# Altium schematic sheet 501_RPiCM4.SchDoc: RPi Compute Module 4
size A2; Organization: Greenfield Tech Solutions; Address1: Molendreef 33; Address2: Ossendrecht; Address3: 4641CS; Address4: The Netherlands; SheetNumber: 6; SheetTotal: 8
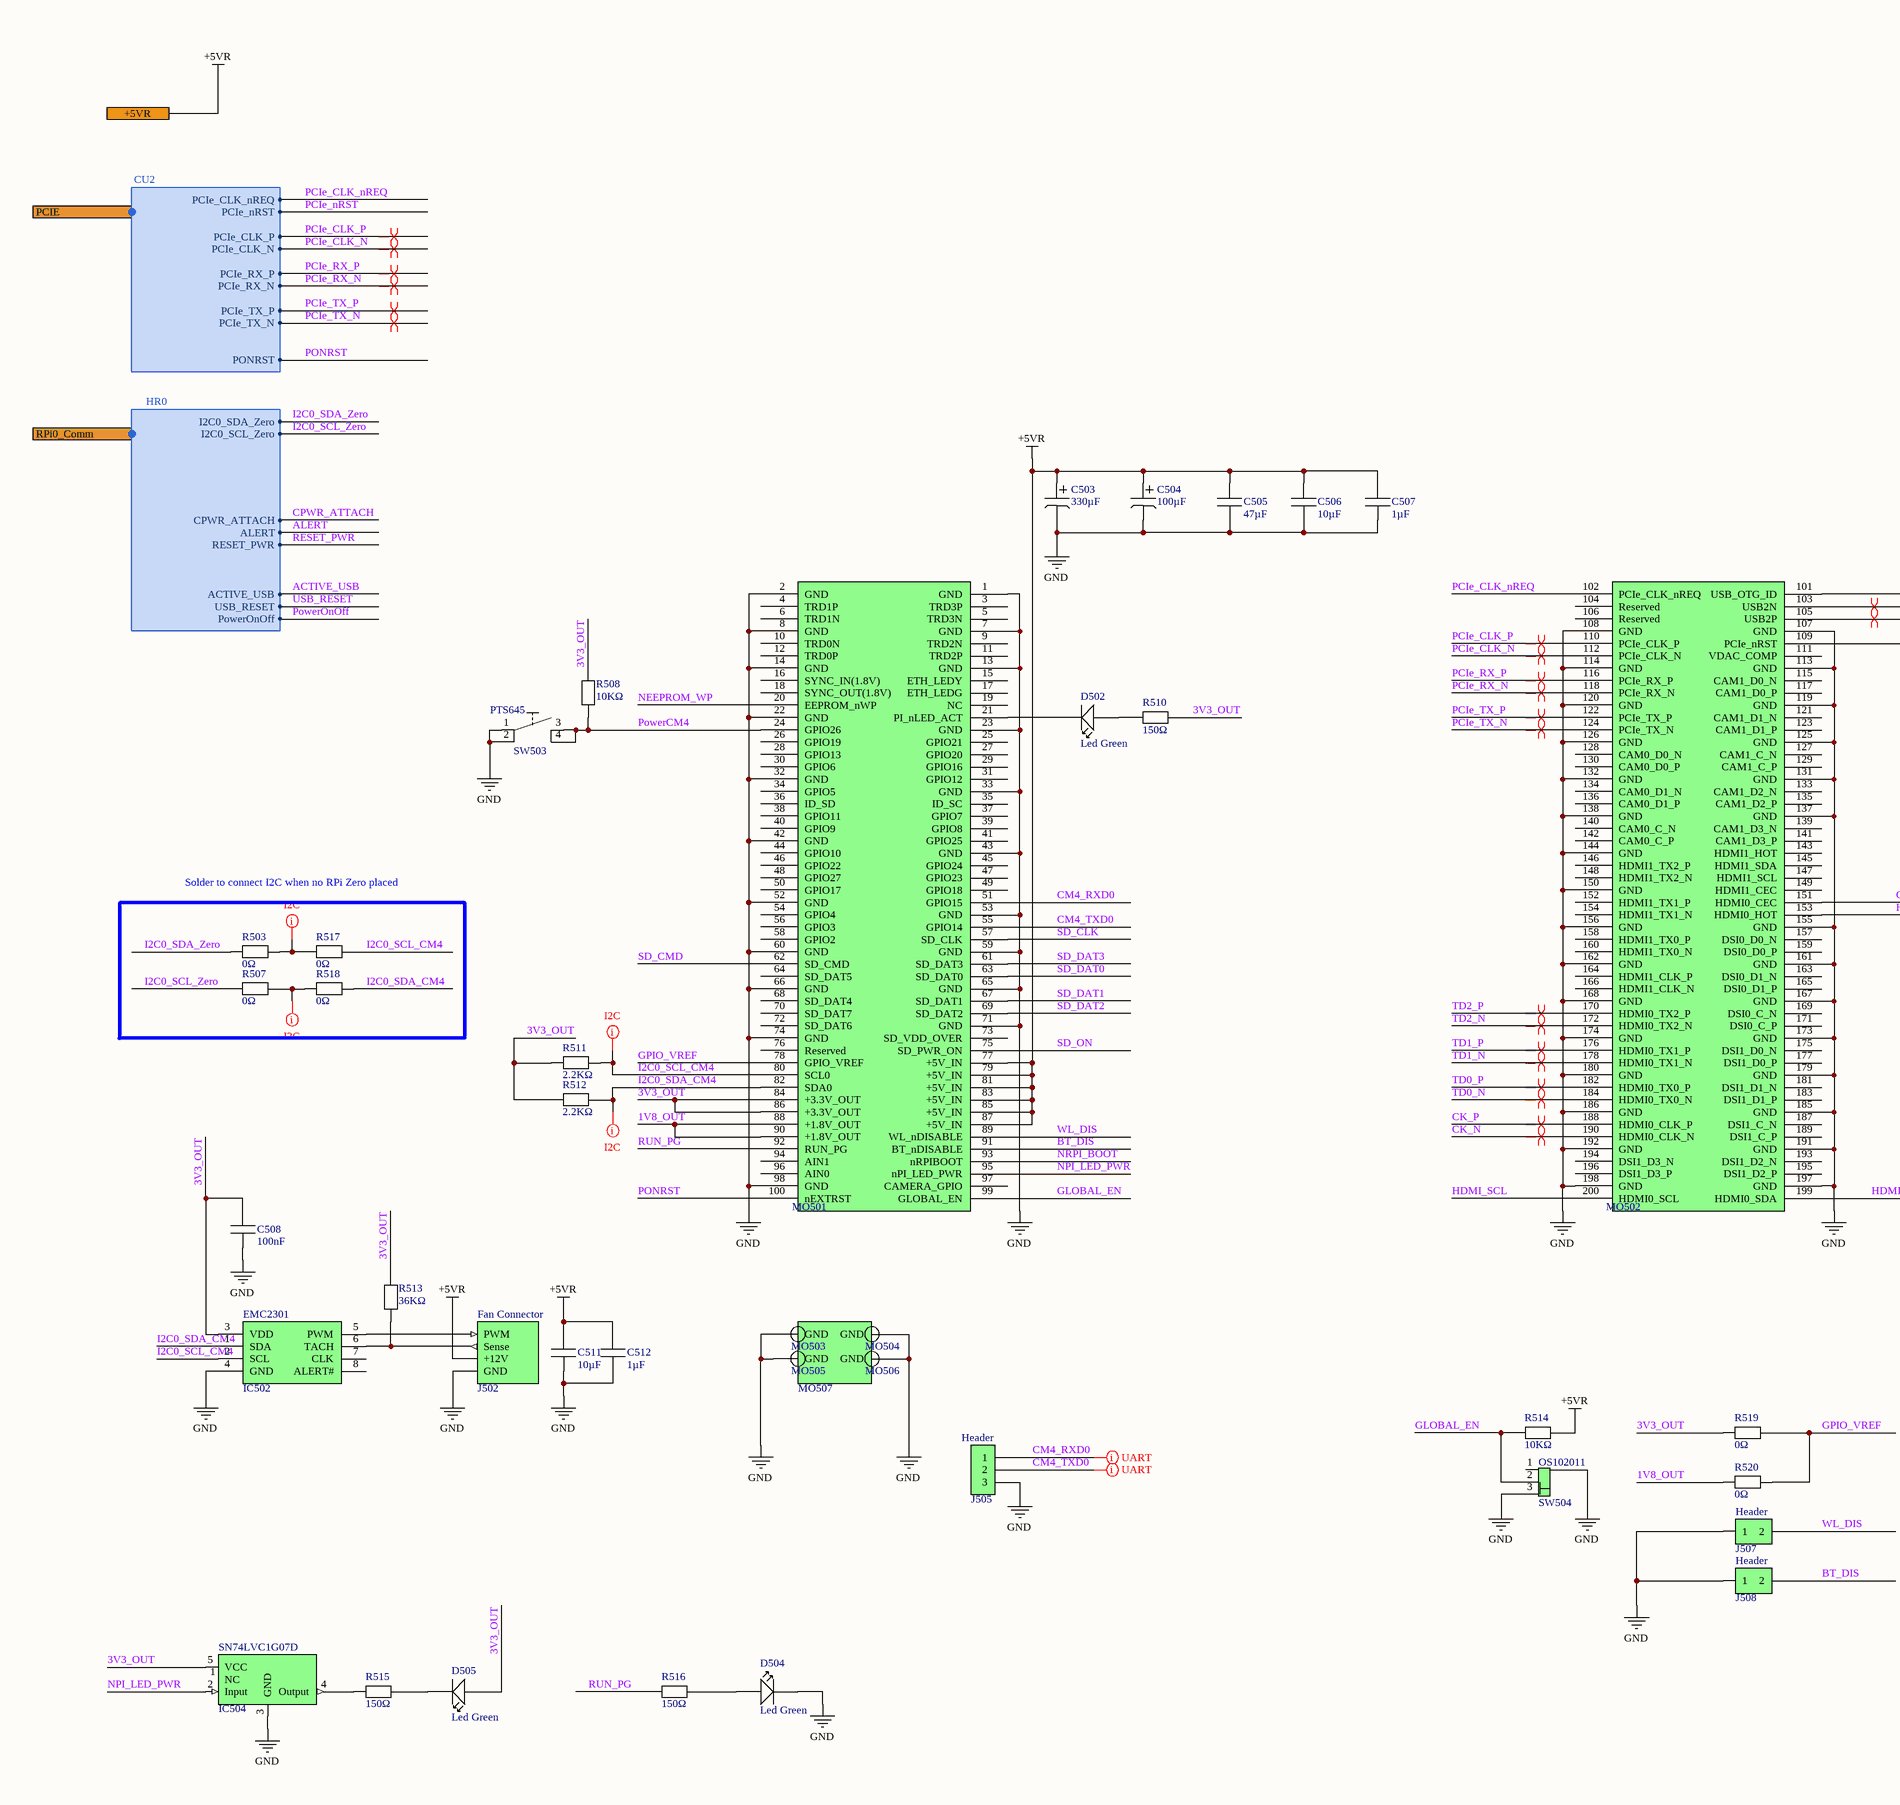
[diagram p0: 501_RPiCM4.SchDoc, left]
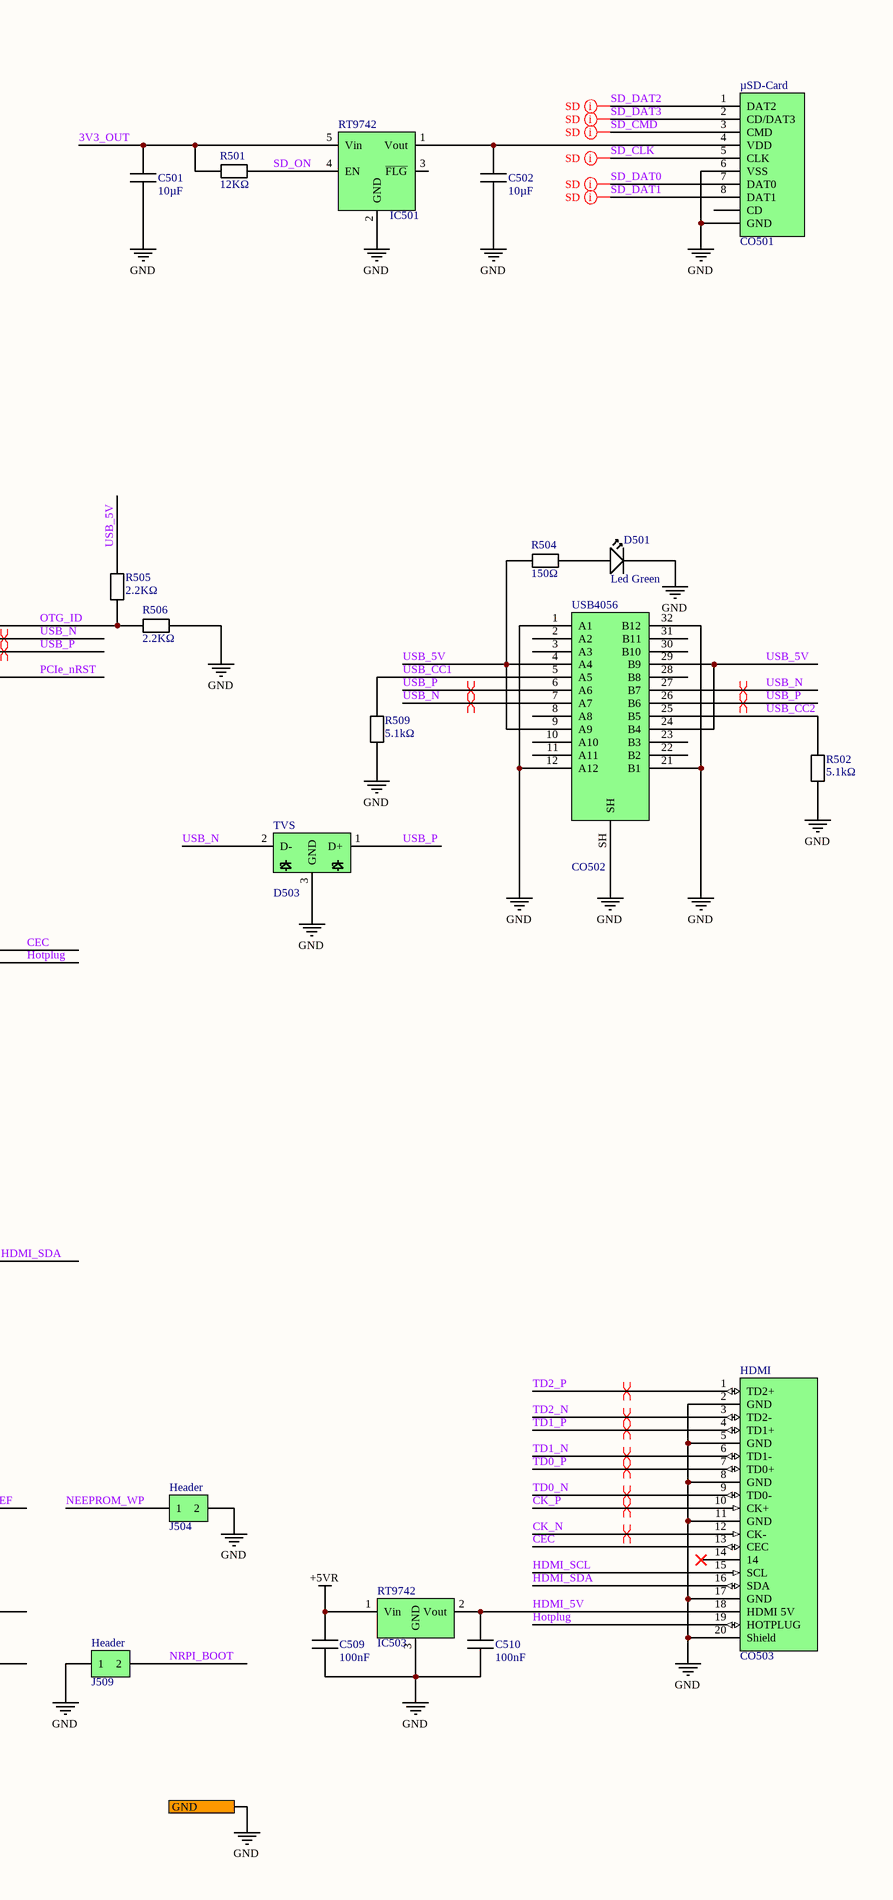
[diagram p1: 501_RPiCM4.SchDoc, right]

## Parts
C501  10µF  [C0603]
C502  10µF  [C0603]
C503  330µF  [EC_E7]
C504  100µF  [EC_B6]
C505  47µF  [C1210]
C506  10µF  [C0603]
C507  1µF  [C0603]
C508  100nF  [C0402]
C509  100nF  [C0402]
C510  100nF  [C0402]
C511  10µF  [C0603]
C512  1µF  [C0603]
CO501  µSD-Card  [693071030811]
CO502  USB4056  [USB4056-03-A]
CO503  HDMI  [HDMI]
D501  Led Green  [Led0805]
D502  Led Green  [Led0805]
D503  TVS  [SOT-3]
D504  Led Green  [Led0805]
D505  Led Green  [Led0805]
IC501  RT9742  [SOT-23-5]
IC502  EMC2301  [MSOP-8_3X3]
IC503  RT9742  [SOT-23]
IC504  SN74LVC1G07D  [SOT-23-5]
J502  Fan Connector  [470531000]
J504  Header  [1X2P_2.54mm]
J505  Header  [1X3P_2.54mm]
J507  Header  [1X2P_2.54mm]
J508  Header  [1X2P_2.54mm]
J509  Header  [1X2P_2.54mm]
MO501  CM4-1  [CM4_001-100]  (value not drawn)
MO502  CM4-2  [CM4_101-200]  (value not drawn)
MO503  CM4-M  [CM4-M]  (value not drawn)
MO504  CM4-M  [CM4-M]  (value not drawn)
MO505  CM4-M  [CM4-M]  (value not drawn)
MO506  CM4-M  [CM4-M]  (value not drawn)
MO507  CM4  [RPICM4_Layout]  (value not drawn)
R501  12KΩ  [R0402]
R502  5.1kΩ  [R0402]
R503  0Ω  [R0402]
R504  150Ω  [R0603]
R505  2.2KΩ  [R0402]
R506  2.2KΩ  [R0402]
R507  0Ω  [R0402]
R508  10KΩ  [R0402]
R509  5.1kΩ  [R0402]
R510  150Ω  [R0603]
R511  2.2KΩ  [R0402]
R512  2.2KΩ  [R0402]
R513  36KΩ  [R0402]
R514  10KΩ  [R0603]
R515  150Ω  [R0603]
R516  150Ω  [R0603]
R517  0Ω  [R0402]
R518  0Ω  [R0402]
R519  0Ω  [R0402]
R520  0Ω  [R0402]
SW503  PTS645  [PTS645-V]
SW504  OS102011  [OS10_Series]

## Blocks framed on the sheet
Solder to connect I2C when no RPi Zero placed: R503 R507 R517 R518

## Ports
+5VR, GND, PCIE (harness CU2), RPi0_Comm (harness HR0)

## Harnesses
CU2: PCIe_nRST, PCIe_CLK_nREQ, PCIe_CLK_N, PCIe_CLK_P, PCIe_RX_N, PCIe_RX_P, PCIe_TX_N, PCIe_TX_P, PONRST
HR0: I2C0_SCL_Zero, I2C0_SDA_Zero, CPWR_ATTACH, PowerOnOff, USB_RESET, ACTIVE_USB, ALERT, RESET_PWR

## Nets
+5VR: C503.1 C504.1 C505.1 C506.1 C507.1 C509.1 C511.1 C512.1 IC503.1(Vin) J502.3(+12V) MO501.77(+5V_IN) MO501.79(+5V_IN) MO501.81(+5V_IN) MO501.83(+5V_IN) MO501.85(+5V_IN) MO501.87(+5V_IN) R514.2 ; port +5VR
GND: C501.2 C502.2 C503.2 C504.2 C505.2 C506.2 C507.2 C508.2 C509.2 C510.2 C511.2 C512.2 CO501.6(VSS) CO501.GND CO502.1(A1) CO502.12(A12) CO502.21(B1) CO502.32(B12) CO502.SH CO503.2(GND) CO503.5(GND) CO503.8(GND) CO503.11(GND) CO503.17(GND) CO503.20(Shield) D501.K D503.3(GND) D504.K IC501.2(GND) IC502.4(GND) IC503.3(GND) IC504.3(GND) J502.4(GND) J504.2 J505.3 J507.1 J508.1 J509.1 MO501.1(GND) MO501.2(GND) MO501.7(GND) MO501.8(GND) MO501.13(GND) MO501.14(GND) MO501.22(GND) MO501.23(GND) MO501.32(GND) MO501.33(GND) MO501.42(GND) MO501.43(GND) MO501.52(GND) MO501.53(GND) MO501.59(GND) MO501.60(GND) MO501.65(GND) MO501.66(GND) MO501.71(GND) MO501.74(GND) MO501.98(GND) MO502.107(GND) MO502.108(GND) MO502.113(GND) MO502.114(GND) MO502.119(GND) MO502.120(GND) MO502.125(GND) MO502.126(GND) MO502.131(GND) MO502.132(GND) MO502.137(GND) MO502.138(GND) MO502.144(GND) MO502.150(GND) MO502.155(GND) MO502.156(GND) MO502.161(GND) MO502.162(GND) MO502.167(GND) MO502.168(GND) MO502.173(GND) MO502.174(GND) MO502.179(GND) MO502.180(GND) MO502.185(GND) MO502.186(GND) MO502.191(GND) MO502.192(GND) MO502.197(GND) MO502.198(GND) MO503.GND MO504.GND MO505.GND MO506.GND R502.1 R506.1 R509.1 SW503.1 SW503.2 SW504.3 SW504.GND ; port GND
1V8_OUT: MO501.88(+1.8V_OUT) MO501.90(+1.8V_OUT) R520.1
3V3_OUT: C501.1 C508.1 D505.A IC501.5(Vin) IC502.3(VDD) IC504.5(VCC) MO501.84(+3.3V_OUT) MO501.86(+3.3V_OUT) R501.1 R508.2 R510.2 R511.1 R512.1 R513.2 R519.1
ACTIVE_USB: port RPi0_Comm.ACTIVE_USB
ALERT: port RPi0_Comm.ALERT
BT_DIS: J508.2 MO501.91(BT_nDISABLE)
CEC: CO503.13(CEC) MO502.151(HDMI0_CEC)
CK_N: CO503.12(CK-) MO502.190(HDMI0_CLK_N)
CK_P: CO503.10(CK+) MO502.188(HDMI0_CLK_P)
CM4_RXD0: J505.1 MO501.51(GPIO15)
CM4_TXD0: J505.2 MO501.55(GPIO14)
CPWR_ATTACH: port RPi0_Comm.CPWR_ATTACH
GLOBAL_EN: MO501.99(GLOBAL_EN) R514.1 SW504.2
GPIO_VREF: MO501.78(GPIO_VREF) R519.2 R520.2
HDMI_5V: C510.1 CO503.18(HDMI_5V) IC503.2(Vout)
HDMI_SCL: CO503.15(SCL) MO502.200(HDMI0_SCL)
HDMI_SDA: CO503.16(SDA) MO502.199(HDMI0_SDA)
Hotplug: CO503.19(HOTPLUG) MO502.153(HDMI0_HOT)
I2C0_SCL_CM4: IC502.2(SCL) MO501.80(SCL0) R511.2 R517.2
I2C0_SCL_Zero: R507.1 ; port RPi0_Comm.I2C0_SCL_Zero
I2C0_SDA_CM4: IC502.1(SDA) MO501.82(SDA0) R512.2 R518.2
I2C0_SDA_Zero: R503.1 ; port RPi0_Comm.I2C0_SDA_Zero
NEEPROM_WP: J504.1 MO501.20(EEPROM_nWP)
NPI_LED_PWR: IC504.2(Input) MO501.95(nPI_LED_PWR)
NRPI_BOOT: J509.2 MO501.93(nRPIBOOT)
OTG_ID: MO502.101(USB_OTG_ID) R505.1 R506.2
PCIe_CLK_N: MO502.112(PCIe_CLK_N) ; port PCIE.PCIe_CLK_N
PCIe_CLK_nREQ: MO502.102(PCIe_CLK_nREQ) ; port PCIE.PCIe_CLK_nREQ
PCIe_CLK_P: MO502.110(PCIe_CLK_P) ; port PCIE.PCIe_CLK_P
PCIe_nRST: MO502.109(PCIe_nRST) ; port PCIE.PCIe_nRST
PCIe_RX_N: MO502.118(PCIe_RX_N) ; port PCIE.PCIe_RX_N
PCIe_RX_P: MO502.116(PCIe_RX_P) ; port PCIE.PCIe_RX_P
PCIe_TX_N: MO502.124(PCIe_TX_N) ; port PCIE.PCIe_TX_N
PCIe_TX_P: MO502.122(PCIe_TX_P) ; port PCIE.PCIe_TX_P
PONRST: MO501.100(nEXTRST) ; port PCIE.PONRST
PowerCM4: MO501.24(GPIO26) R508.1 SW503.3 SW503.4
PowerOnOff: port RPi0_Comm.PowerOnOff
RESET_PWR: port RPi0_Comm.RESET_PWR
RUN_PG: MO501.92(RUN_PG) R516.1
SD_CLK: CO501.5(CLK) MO501.57(SD_CLK)
SD_CMD: CO501.3(CMD) MO501.62(SD_CMD)
SD_DAT0: CO501.7(DAT0) MO501.63(SD_DAT0)
SD_DAT1: CO501.8(DAT1) MO501.67(SD_DAT1)
SD_DAT2: CO501.1(DAT2) MO501.69(SD_DAT2)
SD_DAT3: CO501.2(CD/DAT3) MO501.61(SD_DAT3)
SD_ON: IC501.4(EN) MO501.75(SD_PWR_ON) R501.2
TD0_N: CO503.9(TD0-) MO502.184(HDMI0_TX0_N)
TD0_P: CO503.7(TD0+) MO502.182(HDMI0_TX0_P)
TD1_N: CO503.6(TD1-) MO502.178(HDMI0_TX1_N)
TD1_P: CO503.4(TD1+) MO502.176(HDMI0_TX1_P)
TD2_N: CO503.3(TD2-) MO502.172(HDMI0_TX2_N)
TD2_P: CO503.1(TD2+) MO502.170(HDMI0_TX2_P)
USB_5V: CO502.4(A4) CO502.9(A9) CO502.24(B4) CO502.29(B9) R504.1 R505.2
USB_CC1: CO502.5(A5) R509.2
USB_CC2: CO502.25(B5) R502.2
USB_N: CO502.7(A7) CO502.27(B7) D503.2(D-) MO502.103(USB2N)
USB_P: CO502.6(A6) CO502.26(B6) D503.1(D+) MO502.105(USB2P)
USB_RESET: port RPi0_Comm.USB_RESET
WL_DIS: J507.2 MO501.89(WL_nDISABLE)
NetC502_1: C502.1 CO501.4(VDD) IC501.1(Vout)
NetD501_A: D501.A R504.2
NetD502_A: D502.A R510.1
NetD502_K: D502.K MO501.21(PI_nLED_ACT)
NetD504_A: D504.A R516.2
NetD505_K: D505.K R515.2
NetIC502_5: IC502.5(PWM) J502.1(PWM)
NetIC502_6: IC502.6(TACH) J502.2(Sense) R513.1
NetIC504_4: IC504.4(Output) R515.1
NetR503_2: R503.2 R517.1
NetR507_2: R507.2 R518.1

Not connected (* = marked no-connect by the designer): CO501 CD; CO502 2(A2) 3(A3) 8(A8) 10(A10) 11(A11) 22(B2) 23(B3) 28(B8) 30(B10) 31(B11); CO503 14*; IC501 3(~{FLG}); IC502 7(CLK) 8(ALERT#); IC504 1(NC); MO501 3(TRD3P) 4(TRD1P) 5(TRD3N) 6(TRD1N) 9(TRD2N) 10(TRD0N) 11(TRD2P) 12(TRD0P) 15(ETH_LEDY) 16(SYNC_IN(1.8V)) 17(ETH_LEDG) 18(SYNC_OUT(1.8V)) 19(NC) 25(GPIO21) 26(GPIO19) 27(GPIO20) 28(GPIO13) 29(GPIO16) 30(GPIO6) 31(GPIO12) 34(GPIO5) 35(ID_SC) 36(ID_SD) 37(GPIO7) 38(GPIO11) 39(GPIO8) 40(GPIO9) 41(GPIO25) 44(GPIO10) 45(GPIO24) 46(GPIO22) 47(GPIO23) 48(GPIO27) 49(GPIO18) 50(GPIO17) 54(GPIO4) 56(GPIO3) 58(GPIO2) 64(SD_DAT5) 68(SD_DAT4) 70(SD_DAT7) 72(SD_DAT6) 73(SD_VDD_OVER) 76(Reserved) 94(AIN1) 96(AIN0) 97(CAMERA_GPIO); MO502 104(Reserved) 106(Reserved) 111(VDAC_COMP) 115(CAM1_D0_N) 117(CAM1_D0_P) 121(CAM1_D1_N) 123(CAM1_D1_P) 127(CAM1_C_N) 128(CAM0_D0_N) 129(CAM1_C_P) 130(CAM0_D0_P) 133(CAM1_D2_N) 134(CAM0_D1_N) 135(CAM1_D2_P) 136(CAM0_D1_P) 139(CAM1_D3_N) 140(CAM0_C_N) 141(CAM1_D3_P) 142(CAM0_C_P) 143(HDMI1_HOT) 145(HDMI1_SDA) 146(HDMI1_TX2_P) 147(HDMI1_SCL) 148(HDMI1_TX2_N) 149(HDMI1_CEC) 152(HDMI1_TX1_P) 154(HDMI1_TX1_N) 157(DSI0_D0_N) 158(HDMI1_TX0_P) 159(DSI0_D0_P) 160(HDMI1_TX0_N) 163(DSI0_D1_N) 164(HDMI1_CLK_P) 165(DSI0_D1_P) 166(HDMI1_CLK_N) 169(DSI0_C_N) 171(DSI0_C_P) 175(DSI1_D0_N) 177(DSI1_D0_P) 181(DSI1_D1_N) 183(DSI1_D1_P) 187(DSI1_C_N) 189(DSI1_C_P) 193(DSI1_D2_N) 194(DSI1_D3_N) 195(DSI1_D2_P) 196(DSI1_D3_P); SW504 1

## Layout directives
differential pair; differential pair class HDMI: CK_N, CK_P, TD0_N, TD0_P, TD1_N, TD1_P, TD2_N, TD2_P
differential pair; differential pair class USB3: USB_N, USB_P
net class SD_CM4: SD_CLK, SD_CMD, SD_DAT0, SD_DAT1, SD_DAT2, SD_DAT3
differential pair; differential pair class PCIE: PCIe_CLK_N, PCIe_CLK_P, PCIe_RX_N, PCIe_RX_P, PCIe_TX_N, PCIe_TX_P
net class UART_CM4: CM4_RXD0, CM4_TXD0
net class I2C_CM4: I2C0_SCL_CM4, I2C0_SDA_CM4
net class I2C_COM: NetR503_2, NetR507_2

## Notes on the sheet
- Title
- Size:
- Date:
- File:
- A2
- Number:
- Time:
- Revision:
- Sheet
- of

## Library data of the parts
C501 C502 C506 C511 = CA0008: 10µF 16V 20% X5R; Part Number: CA0008; ManfactPart: GRM188R61C106MAALD; ID: 8; RefVal: 10µF
C503 = CA0012: 330µF 16V 20% 16mΩ 4100mA; Part Number: CA0012; ManfactPart: 16SVPG330MX; ID: 12; RefVal: 330µF
C504 = CA0011: 100µF 16V 20% 15mΩ 4000mA; Part Number: CA0011; ManfactPart: 16SVPG100M; ID: 11; RefVal: 100µF
C505 = CA0007: 47µF 16V 20% X5R; Part Number: CA0007; ManfactPart: EMK325ABJ476MM8P; ID: 7; RefVal: 47µF
C507 C512 = CA0003: 1µF 16V 10% X5R; Part Number: CA0003; ManfactPart: C1608X5R1C105K080AA; ID: 3; RefVal: 1µF
C508-C510 = CA0010: 100nF 16V 10% X7R; Part Number: CA0010; ManfactPart: GCM155R71C104KA55D; ID: 10; RefVal: 100nF
CO501 = CO0027: µSD-Card holder; Part Number: CO0027; ID: 24; RefVal: µSD-Card; ManfactPart: 693071030811
CO502 = CO0030: USB C connector Receptacle Horizontal; Part Number: CO0030; ID: 29; RefVal: USB4056; ManfactPart: USB4056-03-A
CO503 = CO0007: Part Number: CO0007; ManfactPart: 10029449; ID: 7; RefVal: HDMI
D501 D502 D504 D505 = DI0001: Part Number: DI0001; ManfactPart: KP-2012CGCK; ID: 1; RefVal: Led Green
D503 = DI0002: USB 2 TVS Diode; Part Number: DI0002; ManfactPart: TPD2EUSB30DRTR; ID: 2; RefVal: TVS
IC501 = IC0029: RT9742 High side power switch; Part Number: IC0029; ManfactPart: RT9742GGJ5; ID: 29; RefVal: RT9742
IC502 = IC0054: Board Mount Temperature Sensors Single RPB-Based PWM Fan Speed CNTRL; Part Number: IC0054; ManfactPart: EMC2301-1-ACZL-TR; ID: 54; RefVal: EMC2301
IC503 = IC0011: RT9742SNGV; Part Number: IC0011; ID: 11; RefVal: RT9742; ManfactPart: RT9742SNGV
IC504 = IC0009: Buffer IC; Part Number: IC0009; ManfactPart: SN74LVC1G07DBVT; ID: 9; RefVal: SN74LVC1G07D
J502 = CO0010: Fan Connector 4pin; Part Number: CO0010; ID: 10; RefVal: Fan Connector; ManfactPart: 470531000
J504 J507-J509 = CO0012: Header 1x2P; Part Number: CO0012; ManfactPart: G800W306018EU; ID: 12; RefVal: Header
J505 = CO0018: Header 1x3P; Part Number: CO0018; ManfactPart: G800W305018EU; ID: 32; RefVal: Header
MO501 = MO0012: RPI CM4 Pin 1-100; Part Number: MO0012; ManfactPart: DF40HC(3.0)-100DS-0.4V; ID: 12; RefVal: CM4-1
MO502 = MO0013: RPI CM4 Pin 101-200; Part Number: MO0013; ManfactPart: DF40HC(3.0)-100DS-0.4V; ID: 13; RefVal: CM4-2
MO503-MO506 = MO0014: RPI CM4 Mounting Studs; Part Number: MO0014; ManfactPart: 9774030151R; ID: 14; RefVal: CM4-M
MO507 = MO0011: Outline of CM4; Part Number: MO0011; ManfactPart: RPI CM4; ID: 11; RefVal: CM4
R501 = RS0015: 12KΩ 1% 62.5mW; Part Number: RS0015; ManfactPart: RC0402FR-1312KL; ID: 15; RefVal: 12KΩ
R502 R509 = RS0038: 5.1KΩ 1% 62.5mW 100PPM; Part Number: RS0038; ManfactPart: CRCW04025K10FKEDC; ID: 38; RefVal: 5.1kΩ
R503 R507 R517-R520 = RS0074: 0Ω 62.5mW; Part Number: RS0074; ManfactPart: 0402WGJ0000TCE; ID: 74; RefVal: 0Ω
R504 R510 R515 R516 = RS0001: 150Ω 1% 100mW; Part Number: RS0001; ManfactPart: MCWR06X1500FTL; ID: 1; RefVal: 150Ω
R505 R506 R511 R512 = RS0020: 2.2KΩ 5% 62.5mW; Part Number: RS0020; ManfactPart: MCMR04X222 JTL; ID: 20; RefVal: 2.2KΩ
R508 = RS0011: 10KΩ 1% 62.5mW; Part Number: RS0011; ManfactPart: WR04X1002FTL; ID: 11; RefVal: 10KΩ
R513 = RS0051: 36KΩ 1% 62.5mW 100PPM; Part Number: RS0051; ManfactPart: ERJ-2RKF3602X; ID: 51; RefVal: 36KΩ
R514 = RS0003: 10KΩ 5% 100mW; Part Number: RS0003; ManfactPart: WR06X103 JTL; ID: 3; RefVal: 10KΩ
SW503 = SW0003: TACTILE SWITCH SPST; Part Number: SW0003; ManfactPart: PTS645VK832LFS; ID: 3; RefVal: PTS645
SW504 = SW0001: Miniature Slide Switch SPDT; Part Number: SW0001; ManfactPart: OS102011MS2QN1; ID: 1; RefVal: OS102011